# EAGLE schematic light (EAGLE 7.2.0)
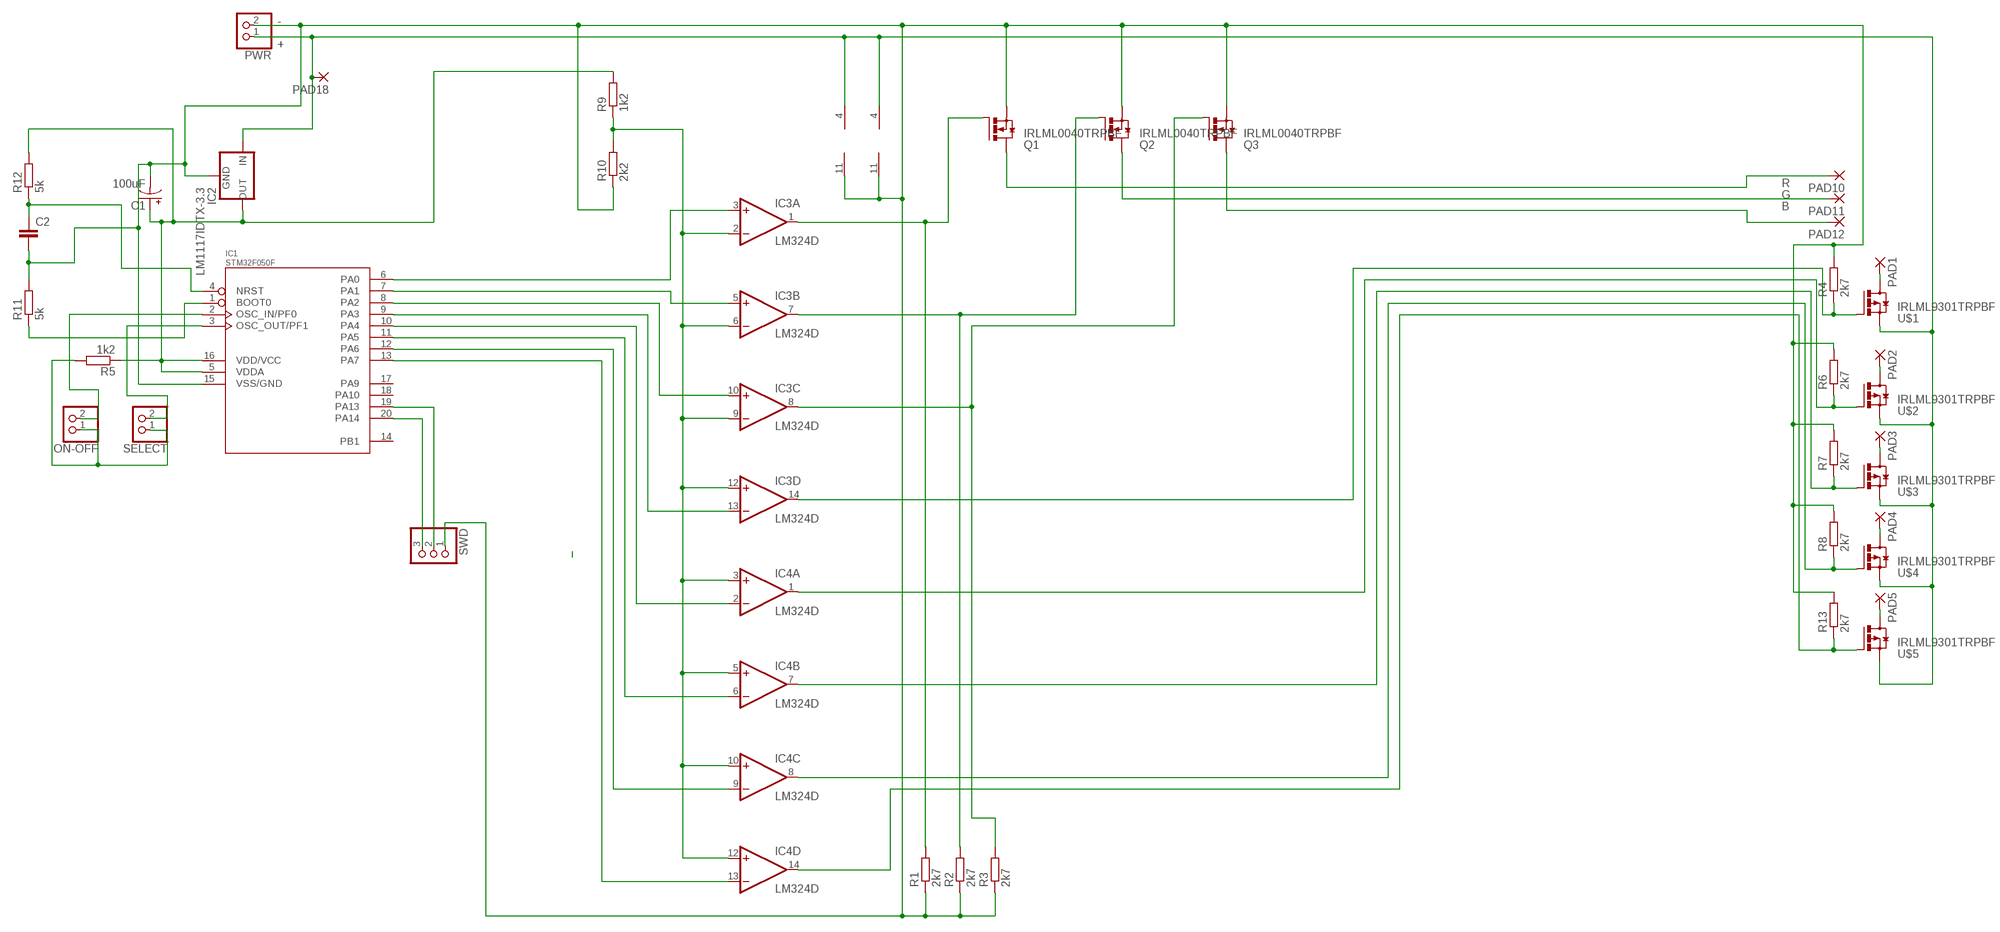
[diagram p0: schematic, sheet 1]

## Parts
C1  100uF  CPOL-USSMCD  [SMC_D]
C2  C-EUC1206  [C1206]
IC1  STM32F050F  [TSSOP20]
IC2  LM1117IDTX-3.3  [TO252]
IC3  LM324D  [SO14]
IC4  LM324D  [SO14]
ON-OFF  PINHD-1X2  [1X02]
PAD1  SMD2  [SMD1,27-2,54]
PAD2  SMD2  [SMD1,27-2,54]
PAD3  SMD2  [SMD1,27-2,54]
PAD4  SMD2  [SMD1,27-2,54]
PAD5  SMD2  [SMD1,27-2,54]
PAD10  SMD2  [SMD1,27-2,54]
PAD11  SMD2  [SMD1,27-2,54]
PAD12  SMD2  [SMD1,27-2,54]
PAD18  SMD2  [SMD1,27-2,54]
PWR  PINHD-1X2  [1X02]
Q1  IRLML0040TRPBF  [MICRO3]
Q2  IRLML0040TRPBF  [MICRO3]
Q3  IRLML0040TRPBF  [MICRO3]
R1  2k7  R-EU_M1206  [M1206]
R2  2k7  R-EU_M1206  [M1206]
R3  2k7  R-EU_M1206  [M1206]
R4  2k7  R-EU_M1206  [M1206]
R5  1k2  R-EU_M1206  [M1206]
R6  2k7  R-EU_M1206  [M1206]
R7  2k7  R-EU_M1206  [M1206]
R8  2k7  R-EU_M1206  [M1206]
R9  1k2  R-EU_M1206  [M1206]
R10  2k2  R-EU_M1206  [M1206]
R11  5k  R-EU_M1206  [M1206]
R12  5k  R-EU_M1206  [M1206]
R13  2k7  R-EU_M1206  [M1206]
SELECT  PINHD-1X2  [1X02]
SWD  PINHD-1X3  [1X03]
U$1  IRLML9301TRPBF  [MICRO3]
U$2  IRLML9301TRPBF  [MICRO3]
U$3  IRLML9301TRPBF  [MICRO3]
U$4  IRLML9301TRPBF  [MICRO3]
U$5  IRLML9301TRPBF  [MICRO3]

## Nets
N$1: IC3.8(C:OUT) Q3.1(G) R3.2
N$2: IC3.7(B:OUT) Q2.1(G) R2.2
N$3: IC3.14(D:OUT) R4.1 U$1.1(G)
N$4: IC4.1(A:OUT) R6.1 U$2.1(G)
N$5: IC2.2(IN) IC3.4(P:V+) IC4.4(P:V+) PAD18.1(P) PWR.1 U$1.2(S) U$2.2(S) U$3.2(S) U$4.2(S) U$5.2(S)
N$6: ON-OFF.1 R5.2 SELECT.1
N$7: PAD10.1(P) Q1.3(D)
N$8: PAD11.1(P) Q2.3(D)
N$9: PAD12.1(P) Q3.3(D)
N$10: IC4.7(B:OUT) R7.1 U$3.1(G)
N$11: IC4.8(C:OUT) R8.1 U$4.1(G)
N$12: IC4.14(D:OUT) R13.1 U$5.1(G)
N$13: IC1.6(PA0) IC3.3(A:+IN)
N$14: IC1.7(PA1) IC3.5(B:+IN)
N$15: IC1.8(PA2) IC3.10(C:+IN)
N$16: IC1.9(PA3) IC3.13(D:-IN)
N$17: IC1.10(PA4) IC4.2(A:-IN)
N$18: IC1.11(PA5) IC4.6(B:-IN)
N$19: IC1.12(PA6) IC4.9(C:-IN)
N$20: IC1.13(PA7) IC4.13(D:-IN)
N$21: PAD1.1(P) U$1.3(D)
N$22: PAD2.1(P) U$2.3(D)
N$23: PAD3.1(P) U$3.3(D)
N$24: IC3.2(A:-IN) IC3.6(B:-IN) IC3.9(C:-IN) IC3.12(D:+IN) IC4.3(A:+IN) IC4.5(B:+IN) IC4.10(C:+IN) IC4.12(D:+IN) R9.1 R10.2
N$25: PAD4.1(P) U$4.3(D)
N$26: PAD5.1(P) U$5.3(D)
N$31: C2.1 IC1.4(NRST) R12.1
N$32: IC1.1(BOOT0) R11.1
N$34: IC1.19(PA13) SWD.2
N$35: IC1.20(PA14) SWD.3
N$37: IC1.2(OSC_IN/PF0) ON-OFF.2
N$39: IC3.1(A:OUT) Q1.1(G) R1.2
N$40: C1.+ IC1.5(VDDA) IC1.16(VDD/VCC) IC2.TAB(OUT) R5.1 R9.2 R12.2
N$45: C1.- C2.2 IC1.15(VSS/GND) IC2.1(GND) IC3.11(P:V-) IC4.11(P:V-) PWR.2 Q1.2(S) Q2.2(S) Q3.2(S) R1.1 R2.1 R3.1 R4.2 R6.2 R7.2 R8.2 R10.1 R11.2 R13.2 SWD.1
N$46: IC1.3(OSC_OUT/PF1) SELECT.2
Unconnected: IC1.14(PB1) IC1.17(PA9) IC1.18(PA10)

## Notes on the sheet
- -
- +
- R
- G
- B

## Library data of the parts
C1 = rcl:CPOL-US: POLARIZED CAPACITOR, American symbol
C2 = rcl:C-EU: CAPACITOR, European symbol
IC1 = STM32F050:STM32F050*: STM32F050xxF*
IC2 = lm1117:LM1117IDTX-*
IC3 IC4 = linear:LM324: OP AMP
ON-OFF PWR SELECT = pinhead:PINHD-1X2: PIN HEADER
PAD1-PAD5 PAD10-PAD12 PAD18 = wirepad:SMD2: SMD PAD
Q1-Q3 = transistor-power:IRLML0040TRPBF: IRLML0040TRPbF NPN MOSFET 40 V 3.6 A
R1-R13 = resistor:R-EU_: RESISTOR, European symbol
SWD = adafruit:PINHD-1X3: PIN HEADER
U$1-U$5 = transistor-power:IRLML9301TRPBF: IRLML9301TRPbF P-MOSFET -30 V -3.6 A